# Altium schematic sheet toplvl.SchDoc
size A3; DrawnBy: Matthias Gareis; Engineer: Matthias Gareis; DocumentNumber: 1; Revision: V0.0; SheetNumber: 1; SheetTotal: 5; VersionControl_RevNumber: 0_0; DocumentName: MicroLPR_DSP; ProjectName: 24GHZ Radar System
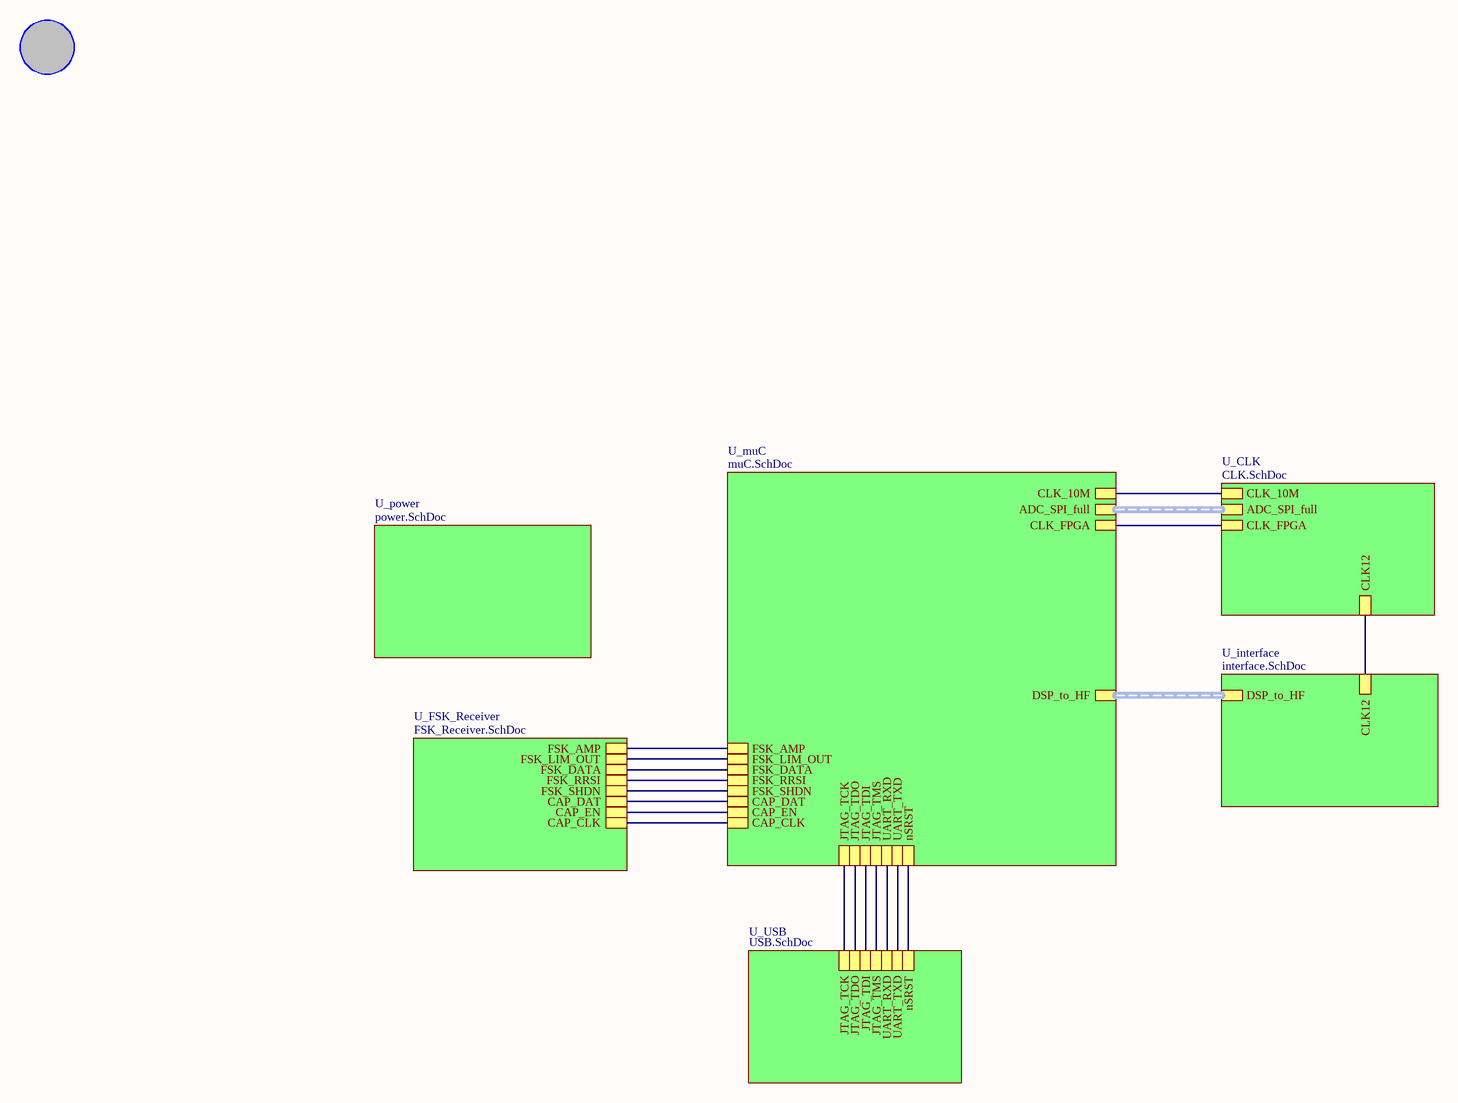
[diagram p0: toplvl.SchDoc]

## Parts
H600  mounting_hole_3_5  [mounting_hole_3_2_rest_3_5]  (value not drawn)

## Sub-sheets
U_CLK = CLK.SchDoc: CLK_10M, ADC_SPI_full (harness ADC_SPI_full), CLK12, CLK_FPGA
U_FSK_Receiver = FSK_Receiver.SchDoc: FSK_AMP, FSK_LIM_OUT, FSK_DATA, FSK_RRSI, FSK_SHDN, CAP_DAT, CAP_EN, CAP_CLK
U_interface = interface.SchDoc: DSP_to_HF (harness DSP_to_HF), CLK12
U_muC = muC.SchDoc: CLK_10M, DSP_to_HF (harness DSP_to_HF), FSK_AMP, FSK_LIM_OUT, FSK_DATA, FSK_RRSI, FSK_SHDN, CAP_DAT, CAP_EN, ADC_SPI_full (harness ADC_SPI_full), CLK_FPGA, JTAG_TCK, JTAG_TDO, JTAG_TDI, JTAG_TMS, UART_RXD, UART_TXD, nSRST, CAP_CLK
U_power = power.SchDoc: no entries
U_USB = USB.SchDoc: JTAG_TCK, JTAG_TDO, JTAG_TDI, JTAG_TMS, UART_RXD, UART_TXD, nSRST

## Nets
(unnamed): sheet U_interface/CLK12, sheet U_CLK/CLK12
(unnamed): sheet U_muC/CLK_10M, sheet U_CLK/CLK_10M
(unnamed): sheet U_muC/FSK_AMP, sheet U_FSK_Receiver/FSK_AMP
(unnamed): sheet U_muC/FSK_LIM_OUT, sheet U_FSK_Receiver/FSK_LIM_OUT
(unnamed): sheet U_muC/FSK_DATA, sheet U_FSK_Receiver/FSK_DATA
(unnamed): sheet U_muC/FSK_RRSI, sheet U_FSK_Receiver/FSK_RRSI
(unnamed): sheet U_muC/FSK_SHDN, sheet U_FSK_Receiver/FSK_SHDN
(unnamed): sheet U_muC/CAP_DAT, sheet U_FSK_Receiver/CAP_DAT
(unnamed): sheet U_muC/CAP_EN, sheet U_FSK_Receiver/CAP_EN
(unnamed): sheet U_muC/CLK_FPGA, sheet U_CLK/CLK_FPGA
(unnamed): sheet U_muC/JTAG_TCK, sheet U_USB/JTAG_TCK
(unnamed): sheet U_muC/JTAG_TDO, sheet U_USB/JTAG_TDO
(unnamed): sheet U_muC/JTAG_TDI, sheet U_USB/JTAG_TDI
(unnamed): sheet U_muC/JTAG_TMS, sheet U_USB/JTAG_TMS
(unnamed): sheet U_muC/UART_RXD, sheet U_USB/UART_RXD
(unnamed): sheet U_muC/UART_TXD, sheet U_USB/UART_TXD
(unnamed): sheet U_muC/nSRST, sheet U_USB/nSRST
(unnamed): sheet U_muC/CAP_CLK, sheet U_FSK_Receiver/CAP_CLK

## Buses and harness runs
harness sheet U_CLK/ADC_SPI_full = sheet U_muC/ADC_SPI_full
harness sheet U_interface/DSP_to_HF = sheet U_muC/DSP_to_HF